# Altium project QUTMS-PDM-V00.PrjPcb (part 1 of 2)
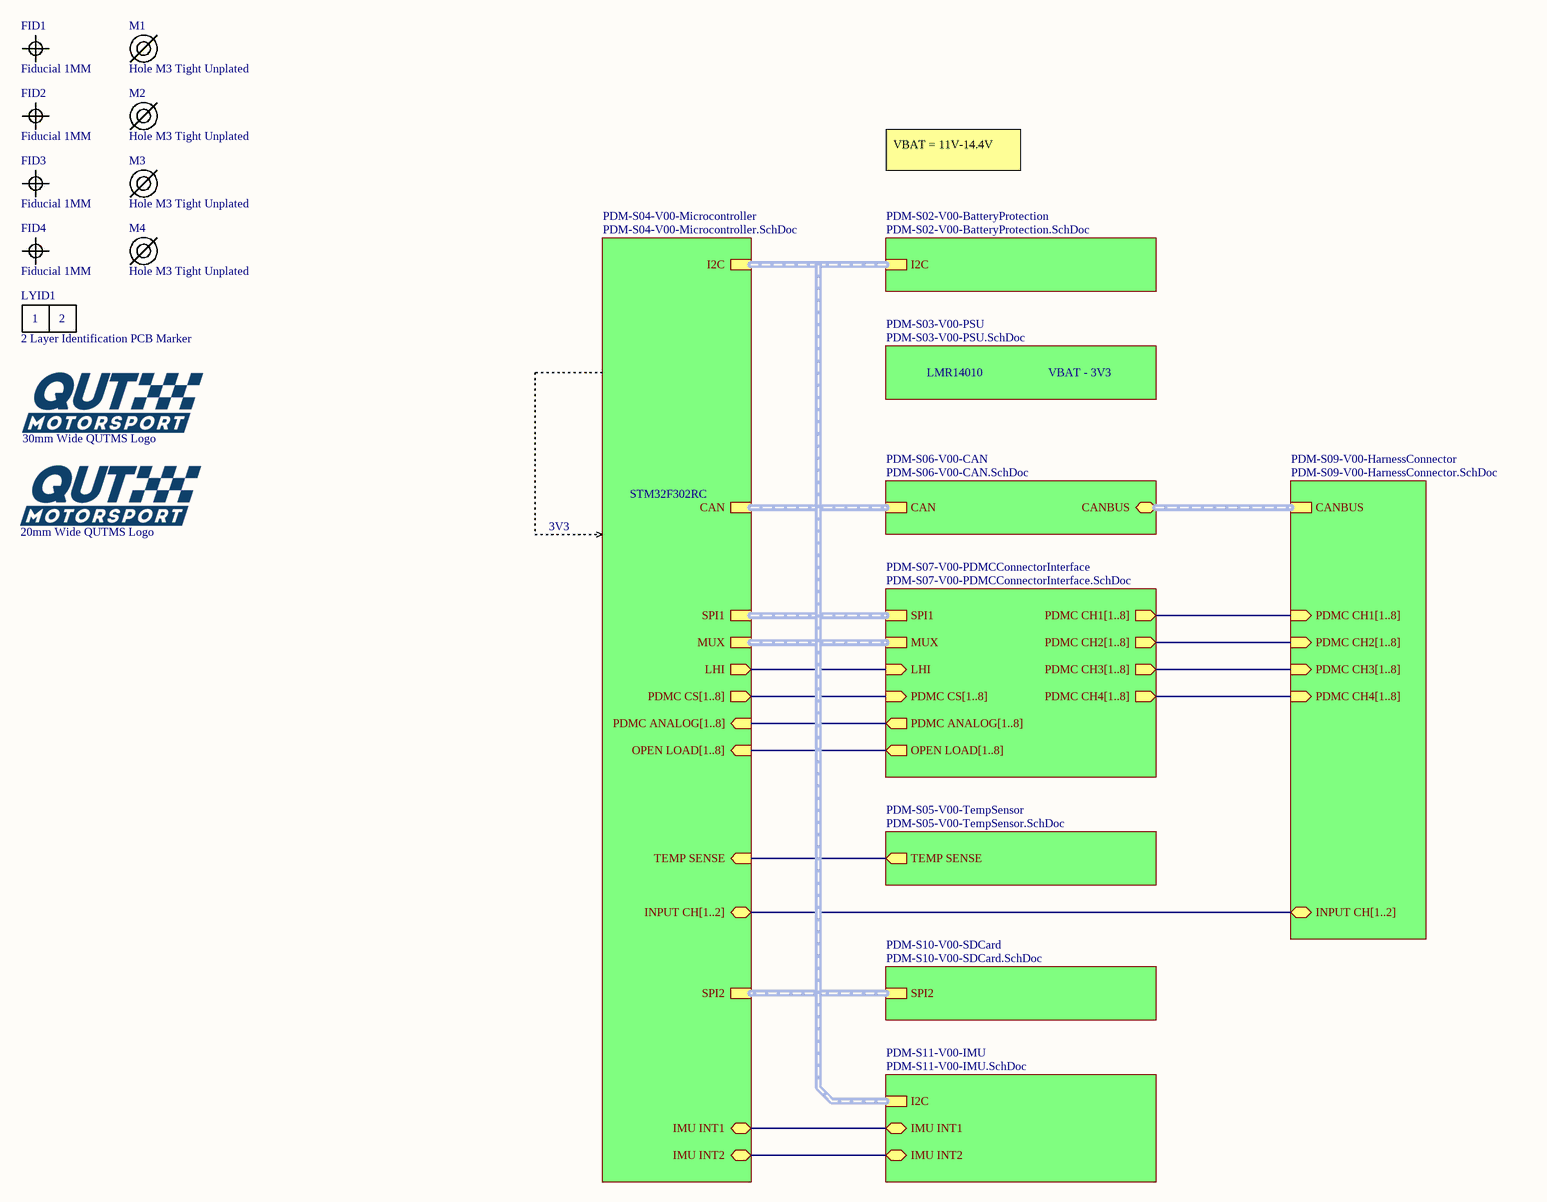
[diagram p0: PDM-S01-V00-PowerDistributionModule.SchDoc]
12 sheets, 95 parts. Net scope: hierarchical (ports join the sheet entries above them; power ports are global).
Board file: PDM-P00-V00.PcbDoc
Sheets:
  PDM-S01-V00-PowerDistributionModule.SchDoc
    PDM-S04-V00-Microcontroller = PDM-S04-V00-Microcontroller.SchDoc
    PDM-S06-V00-CAN = PDM-S06-V00-CAN.SchDoc
    PDM-S09-V00-HarnessConnector = PDM-S09-V00-HarnessConnector.SchDoc
    PDM-S03-V00-PSU = PDM-S03-V00-PSU.SchDoc
    PDM-S02-V00-BatteryProtection = PDM-S02-V00-BatteryProtection.SchDoc
    PDM-S07-V00-PDMCConnectorInterface = PDM-S07-V00-PDMCConnectorInterface.SchDoc
      PDM-S08-V00-PDMCConnector1 = PDM-S08-V00-PDMCConnector.SchDoc
      PDM-S08-V00-PDMCConnector2 = PDM-S08-V00-PDMCConnector.SchDoc
      PDM-S08-V00-PDMCConnector3 = PDM-S08-V00-PDMCConnector.SchDoc
      PDM-S08-V00-PDMCConnector4 = PDM-S08-V00-PDMCConnector.SchDoc
      PDM-S08-V00-PDMCConnector5 = PDM-S08-V00-PDMCConnector.SchDoc
      PDM-S08-V00-PDMCConnector6 = PDM-S08-V00-PDMCConnector.SchDoc
      PDM-S08-V00-PDMCConnector7 = PDM-S08-V00-PDMCConnector.SchDoc
      PDM-S08-V00-PDMCConnector8 = PDM-S08-V00-PDMCConnector.SchDoc
    PDM-S05-V00-TempSensor = PDM-S05-V00-TempSensor.SchDoc
    PDM-S10-V00-SDCard = PDM-S10-V00-SDCard.SchDoc
    PDM-S11-V00-IMU = PDM-S11-V00-IMU.SchDoc
  PDM-S12-V00-InputProtection.SchDoc

## Sheet PDM-S01-V00-PowerDistributionModule.SchDoc: PDM Master
size A3; DrawnBy: Zoe Goodward; Organization: QUT Motorsport; Address1: O-120, Gardens Point; Address2: 2 George Street; Address3: Brisbane, QLD 4000; Address4: Australia; DocumentNumber: 1; Revision: 01; SheetNumber: 1; SheetTotal: 9; Version: 01; Project: Power Distribution Module; PageSetup: Record=PageOptions|CenterHorizontal=True|CenterVertical=True|PrintScale=0.97|XCorrection=1.00|YCorrection=1.00|PrintKind=0|BorderSize=5000000|LeftOffset=0|BottomOffset=0|Orientation=2|PaperLength=1000|PaperWidth=1000|Scale=100|PaperSource=7|PrintQuality=-4|MediaType=1|DitherType=10|PaperKind=A4|PrintScaleMode=1

### Parts
FID1  Fiducial 1MM  [FIDUCIAL 1MM]
FID2  Fiducial 1MM  [FIDUCIAL 1MM]
FID3  Fiducial 1MM  [FIDUCIAL 1MM]
FID4  Fiducial 1MM  [FIDUCIAL 1MM]
LOGO1  30mm Wide QUTMS Logo  [QUTMS LOGO 30MM]
LOGO2  20mm Wide QUTMS Logo  [QUTMS LOGO 20MM]
LYID1  2 Layer Identification PCB Marker  [LAYER IDENT 2]
M1  Hole M3 Tight Unplated  [M3.2 UNPLATED]
M2  Hole M3 Tight Unplated  [M3.2 UNPLATED]
M3  Hole M3 Tight Unplated  [M3.2 UNPLATED]
M4  Hole M3 Tight Unplated  [M3.2 UNPLATED]

### Sub-sheets
PDM-S02-V00-BatteryProtection = PDM-S02-V00-BatteryProtection.SchDoc: I2C (harness I2C)
PDM-S03-V00-PSU = PDM-S03-V00-PSU.SchDoc: no entries
PDM-S04-V00-Microcontroller = PDM-S04-V00-Microcontroller.SchDoc: CAN (harness CAN), LHI (out), MUX (harness MUX), PDMC CS[1..8] (out), PDMC ANALOG[1..8] (in), TEMP SENSE (in), INPUT CH[1..2] (bidir), SPI2 (harness SPI2), I2C (harness I2C), OPEN LOAD[1..8] (in), SPI1 (harness SPI1), IMU INT1 (bidir), IMU INT2 (bidir)
PDM-S05-V00-TempSensor = PDM-S05-V00-TempSensor.SchDoc: TEMP SENSE (out)
PDM-S06-V00-CAN = PDM-S06-V00-CAN.SchDoc: CANBUS (bidir, harness CANBUS), CAN (harness CAN)
PDM-S07-V00-PDMCConnectorInterface = PDM-S07-V00-PDMCConnectorInterface.SchDoc: SPI1 (harness SPI1), PDMC CS[1..8] (in), MUX (harness MUX), PDMC CH4[1..8] (out), PDMC CH2[1..8] (out), LHI (in), PDMC CH1[1..8] (out), PDMC ANALOG[1..8] (out), PDMC CH3[1..8] (out), OPEN LOAD[1..8] (out)
PDM-S09-V00-HarnessConnector = PDM-S09-V00-HarnessConnector.SchDoc: CANBUS (harness CANBUS), PDMC CH1[1..8] (in), PDMC CH2[1..8] (in), PDMC CH3[1..8] (in), PDMC CH4[1..8] (in), INPUT CH[1..2] (bidir)
PDM-S10-V00-SDCard = PDM-S10-V00-SDCard.SchDoc: SPI2 (harness SPI2)
PDM-S11-V00-IMU = PDM-S11-V00-IMU.SchDoc: IMU INT1 (bidir), I2C (harness I2C), IMU INT2 (bidir)

### Nets
IMU INT1: sheet PDM-S04-V00-Microcontroller/IMU INT1, sheet PDM-S11-V00-IMU/IMU INT1
IMU INT2: sheet PDM-S04-V00-Microcontroller/IMU INT2, sheet PDM-S11-V00-IMU/IMU INT2
LHI: sheet PDM-S04-V00-Microcontroller/LHI, sheet PDM-S07-V00-PDMCConnectorInterface/LHI
TEMP SENSE: sheet PDM-S04-V00-Microcontroller/TEMP SENSE, sheet PDM-S05-V00-TempSensor/TEMP SENSE

### Buses and harness runs
bus sheet PDM-S04-V00-Microcontroller/INPUT CH[1..2] = sheet PDM-S09-V00-HarnessConnector/INPUT CH[1..2]
bus sheet PDM-S04-V00-Microcontroller/OPEN LOAD[1..8] = sheet PDM-S07-V00-PDMCConnectorInterface/OPEN LOAD[1..8]
bus sheet PDM-S04-V00-Microcontroller/PDMC ANALOG[1..8] = sheet PDM-S07-V00-PDMCConnectorInterface/PDMC ANALOG[1..8]
bus sheet PDM-S04-V00-Microcontroller/PDMC CS[1..8] = sheet PDM-S07-V00-PDMCConnectorInterface/PDMC CS[1..8]
bus sheet PDM-S07-V00-PDMCConnectorInterface/PDMC CH1[1..8] = sheet PDM-S09-V00-HarnessConnector/PDMC CH1[1..8]
bus sheet PDM-S07-V00-PDMCConnectorInterface/PDMC CH2[1..8] = sheet PDM-S09-V00-HarnessConnector/PDMC CH2[1..8]
bus sheet PDM-S07-V00-PDMCConnectorInterface/PDMC CH3[1..8] = sheet PDM-S09-V00-HarnessConnector/PDMC CH3[1..8]
bus sheet PDM-S07-V00-PDMCConnectorInterface/PDMC CH4[1..8] = sheet PDM-S09-V00-HarnessConnector/PDMC CH4[1..8]
harness sheet PDM-S02-V00-BatteryProtection/I2C = sheet PDM-S04-V00-Microcontroller/I2C = sheet PDM-S11-V00-IMU/I2C
harness sheet PDM-S04-V00-Microcontroller/CAN = sheet PDM-S06-V00-CAN/CAN
harness sheet PDM-S04-V00-Microcontroller/MUX = sheet PDM-S07-V00-PDMCConnectorInterface/MUX
harness sheet PDM-S04-V00-Microcontroller/SPI1 = sheet PDM-S07-V00-PDMCConnectorInterface/SPI1
harness sheet PDM-S04-V00-Microcontroller/SPI2 = sheet PDM-S10-V00-SDCard/SPI2
harness sheet PDM-S06-V00-CAN/CANBUS = sheet PDM-S09-V00-HarnessConnector/CANBUS

### Notes on the sheet
- VBAT = 11V-14.4V
- LMR14010
- VBAT - 3V3
- 3V3
- STM32F302RC
- Revision History:
- Sheet Title:
- Rev
- Date
- Description
- Project:
- Size:
- Drawn By:
- A3
- Number:
- Revision:
- Sheet
- Version:
- of
- QUT Motorsport
- O-120, Gardens Point
- 2 George Street
- Brisbane, QLD 4000
- Australia
- Print Date:
- Print Time:
- File Name:
- (in symbol Layer Identification 2) 1; 2

### Library data of the parts
LOGO1 = QUTMS Logo 30mm
LOGO2 = QUTMS Logo 20mm
LYID1 = Layer Identification 2
M1-M4 = Hole M3 Tight Unplated: M3.2 Hole, No Plating

## Sheet PDM-S04-V00-Microcontroller.SchDoc: Microcontroller
size A3; DrawnBy: Zoe Goodward; Organization: QUT Motorsport; Address1: O-120, Gardens Point; Address2: 2 George Street; Address3: Brisbane, QLD 4000; Address4: Australia; DocumentNumber: 4; Revision: 00; SheetNumber: 4; SheetTotal: 9; Version: 00; Project: Power Distribution Module; PageSetup: Record=PageOptions|CenterHorizontal=True|CenterVertical=True|PrintScale=0.97|XCorrection=1.00|YCorrection=1.00|PrintKind=0|BorderSize=5000000|LeftOffset=0|BottomOffset=0|Orientation=2|PaperLength=1000|PaperWidth=1000|Scale=100|PaperSource=7|PrintQuality=-4|MediaType=1|DitherType=10|PaperKind=A4|PrintScaleMode=1
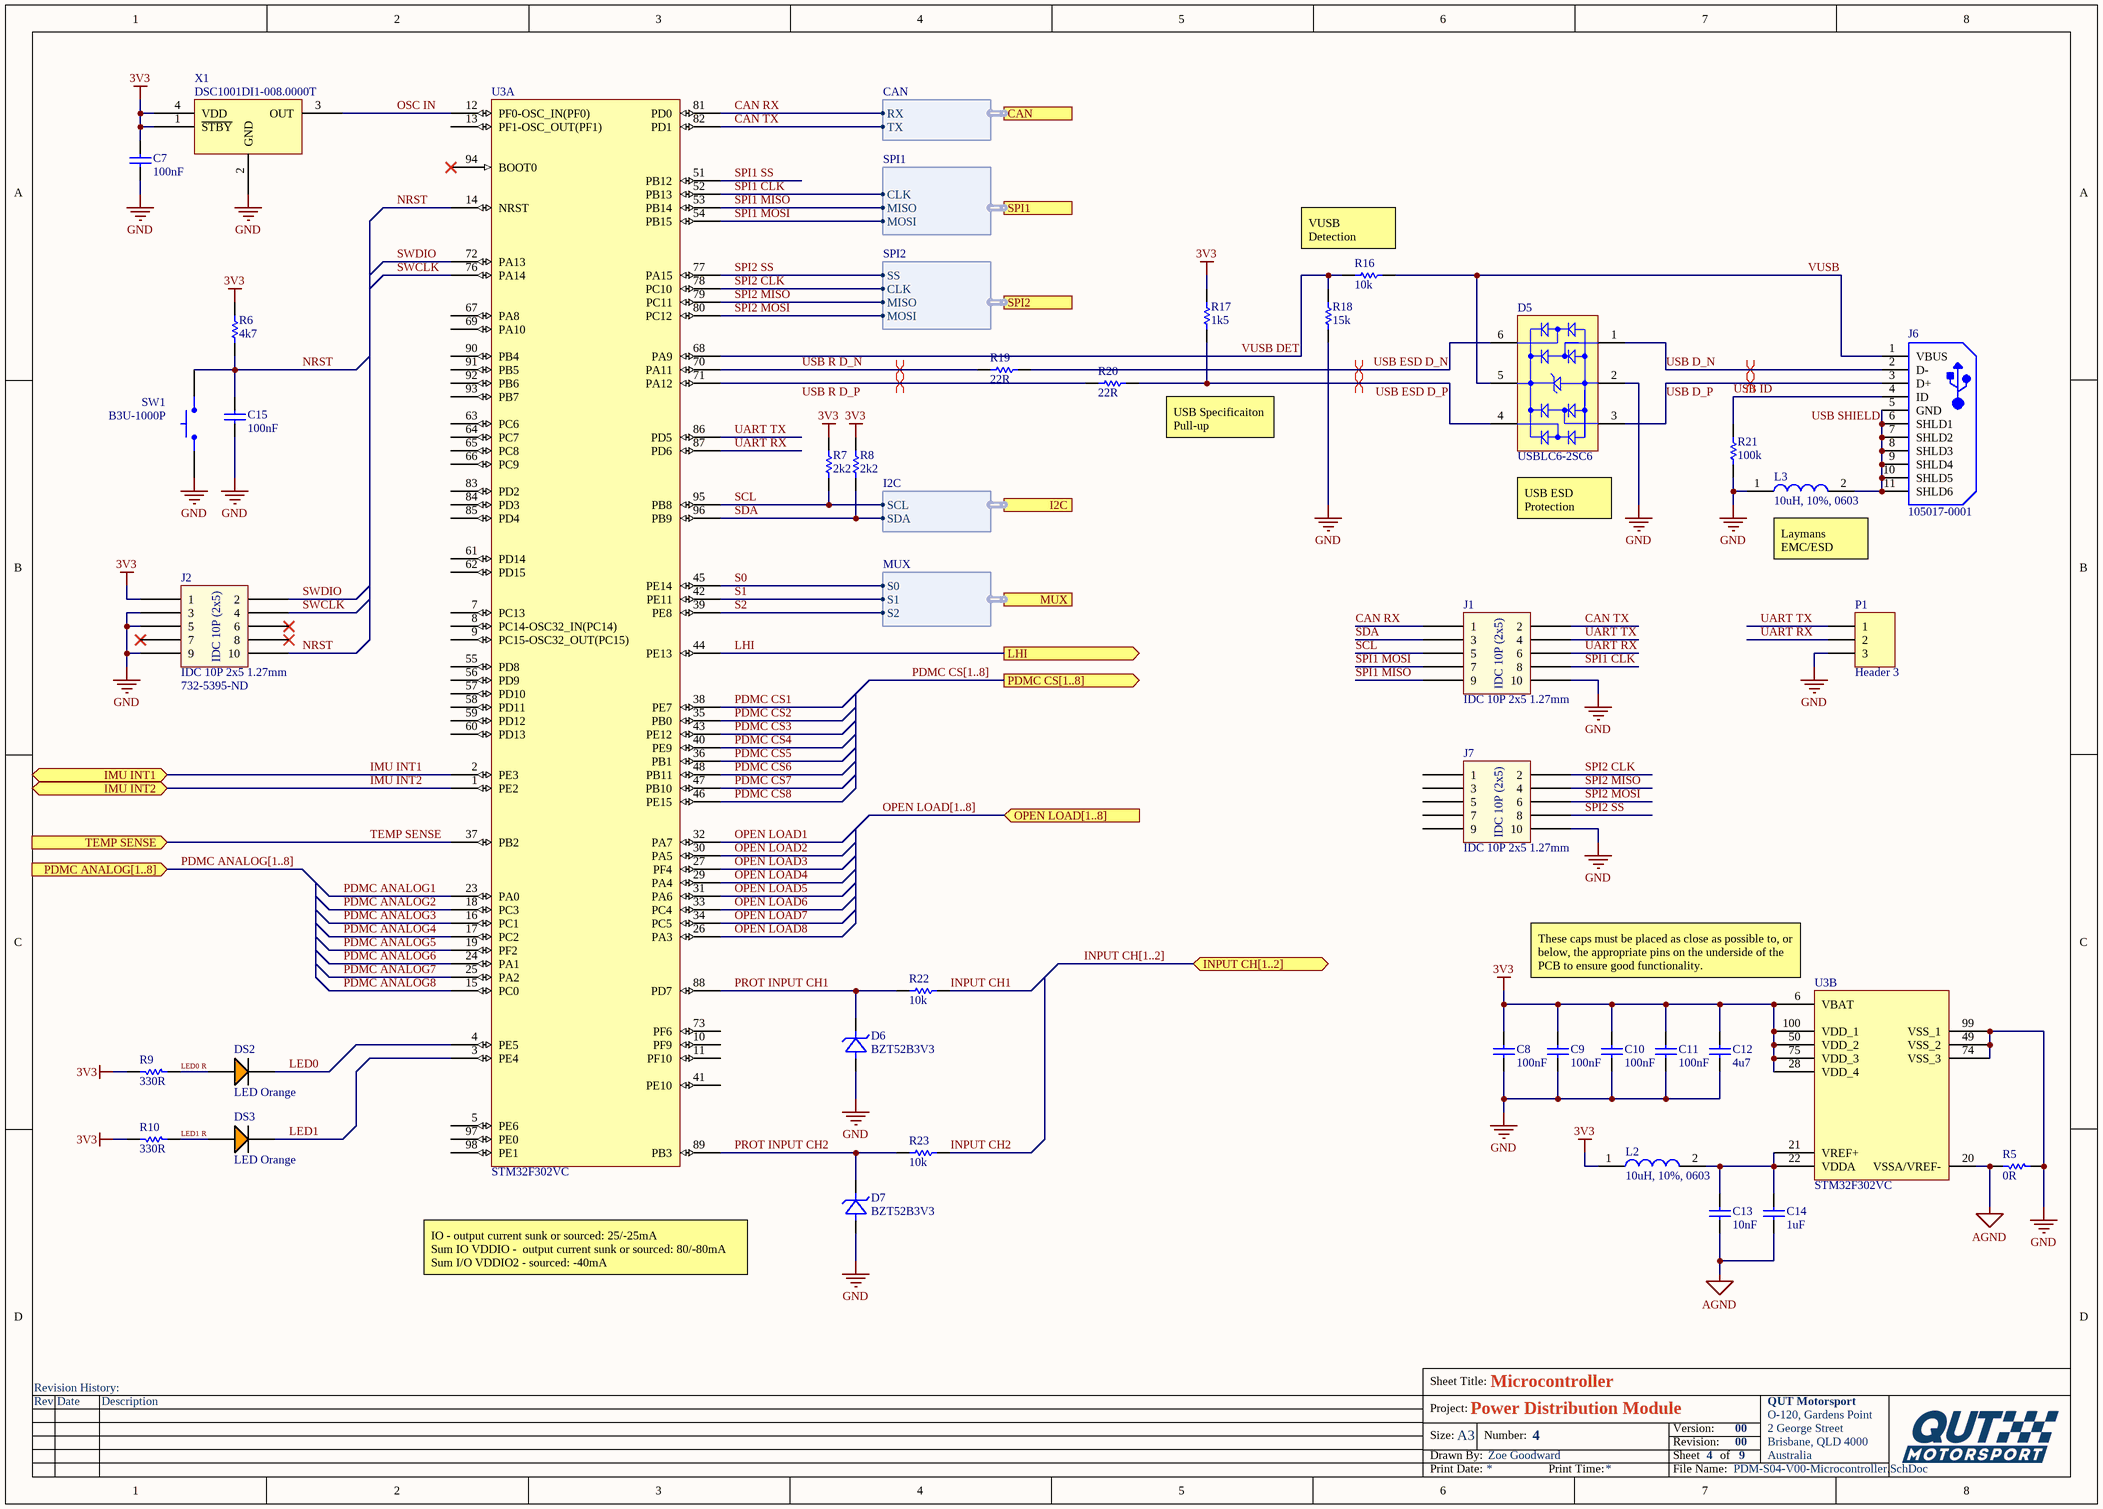
[diagram p1: PDM-S04-V00-Microcontroller.SchDoc]

### Parts
C7  100nF  [Cap_Ceramic_0603]
C8  100nF  [Cap_Ceramic_0603]
C9  100nF  [Cap_Ceramic_0603]
C10  100nF  [Cap_Ceramic_0603]
C11  100nF  [Cap_Ceramic_0603]
C12  4u7  [Cap_Ceramic_0603]
C13  10nF  [Cap_Ceramic_0603]
C14  1uF  [Cap_Ceramic_0603]
C15  100nF  [Cap_Ceramic_0603]
D5  USBLC6-2SC6  [STM-SOT23-6L_V]
D6  BZT52B3V3  [SOD123]
D7  BZT52B3V3  [SOD123]
DS2  LED Orange  [LED ORANGE 0603]
DS3  LED Orange  [LED ORANGE 0603]
J1  IDC 10P 2x5 1.27mm  [IDC 1.27MM 10P]
J2  IDC 10P 2x5 1.27mm  [IDC 1.27MM 10P]
J6  105017-0001  [USB-MICRO-B_V]
J7  IDC 10P 2x5 1.27mm  [IDC 1.27MM 10P]
L2  10uH, 10%, 0603  [Inductor_0603]
L3  10uH, 10%, 0603  [Inductor_0603]
P1  Header 3  [HDR1X3]
R5  0R  [Res_ThinFilm_0603]
R6  4k7  [Res_ThinFilm_0603]
R7  2k2  [Res_ThinFilm_0603]
R8  2k2  [Res_ThinFilm_0603]
R9  330R  [Res_ThinFilm_0603]
R10  330R  [Res_ThinFilm_0603]
R16  10k  [Res_ThinFilm_0603]
R17  1k5  [Res_ThinFilm_0603]
R18  15k  [Res_ThinFilm_0603]
R19  22R  [Res_ThinFilm_0603]
R20  22R  [Res_ThinFilm_0603]
R21  100k  [Res_ThinFilm_0603]
R22  10k  [Res_ThinFilm_0603]
R23  10k  [Res_ThinFilm_0603]
SW1  B3U-1000P  [BTN B3U-1000P]
U3  STM32F302VC  [STM-LQFP100]  (parts A,B of 2)
X1  DSC1001DI1-008.0000T  [DSC1001DI1-008.0000TCT-ND]

### Ports
CAN (harness CAN), I2C (harness I2C), IMU INT1 (bidir), IMU INT2 (bidir), INPUT CH[1..2] (bidir), LHI (out), MUX (harness MUX), OPEN LOAD[1..8] (in), PDMC ANALOG[1..8] (in), PDMC CS[1..8] (out), SPI1 (harness SPI1), SPI2 (harness SPI2), TEMP SENSE (in)

### Harnesses
CAN: RX, TX
SPI1: CLK, MISO, MOSI
MUX: S0, S1, S2
I2C: SDA, SCL
SPI2: CLK, MISO, MOSI, SS

### Nets
3V3: C7.2 C8.2 C9.2 C10.2 C11.2 C12.2 J2.1 L2.1 R6.2 R7.2 R8.2 R9.2 R10.2 R17.2 U3.6(VBAT) U3.28(VDD_4) U3.50(VDD_2) U3.75(VDD_3) U3.100(VDD_1) X1.1(~{STBY}) X1.4(VDD)
AGND: C13.1 C14.1 R5.2 U3.20(VSSA/VREF-)
GND: C7.1 C8.1 C9.1 C10.1 C11.1 C12.1 C15.1 D5.2(GND) D6.A(Anode) D7.A(Anode) J1.10 J2.3 J2.5 J2.9 J7.10 L3.1 P1.3 R5.1 R18.1 R21.1 SW1.1 U3.49(VSS_2) U3.74(VSS_3) U3.99(VSS_1) X1.2(GND)
CAN RX: J1.1 U3.81(PD0) ; port CAN.RX
CAN TX: J1.2 U3.82(PD1) ; port CAN.TX
IMU INT1: U3.2(PE3) ; port IMU INT1
IMU INT2: U3.1(PE2) ; port IMU INT2
INPUT CH1: R22.2
INPUT CH2: R23.2
LED0: DS2.2(C) U3.4(PE5)
LED0 R: DS2.1(A) R9.1
LED1: DS3.2(C) U3.3(PE4)
LED1 R: DS3.1(A) R10.1
LHI: U3.44(PE13) ; port LHI
NRST: C15.2 J2.10 R6.1 SW1.2 U3.14(NRST)
OPEN LOAD1: U3.32(PA7)  [project net OPEN LOAD]
OPEN LOAD2: U3.30(PA5)  [project net OPEN LOAD]
OPEN LOAD3: U3.27(PF4)  [project net OPEN LOAD]
OPEN LOAD4: U3.29(PA4)  [project net OPEN LOAD]
OPEN LOAD5: U3.31(PA6)  [project net OPEN LOAD]
OPEN LOAD6: U3.33(PC4)  [project net OPEN LOAD]
OPEN LOAD7: U3.34(PC5)  [project net OPEN LOAD]
OPEN LOAD8: U3.26(PA3)  [project net OPEN LOAD]
OSC IN: U3.12(PF0-OSC_IN(PF0)) X1.3(OUT)
PDMC ANALOG1: U3.23(PA0)  [project net ANALOG OUT]
PDMC ANALOG2: U3.18(PC3)  [project net ANALOG OUT]
PDMC ANALOG3: U3.16(PC1)  [project net ANALOG OUT]
PDMC ANALOG4: U3.17(PC2)  [project net ANALOG OUT]
PDMC ANALOG5: U3.19(PF2)  [project net ANALOG OUT]
PDMC ANALOG6: U3.24(PA1)  [project net ANALOG OUT]
PDMC ANALOG7: U3.25(PA2)  [project net ANALOG OUT]
PDMC ANALOG8: U3.15(PC0)  [project net ANALOG OUT]
PDMC CS1: U3.38(PE7)  [project net CS]
PDMC CS2: U3.35(PB0)  [project net CS]
PDMC CS3: U3.43(PE12)  [project net CS]
PDMC CS4: U3.40(PE9)  [project net CS]
PDMC CS5: U3.36(PB1)  [project net CS]
PDMC CS6: U3.48(PB11)  [project net CS]
PDMC CS7: U3.47(PB10)  [project net CS]
PDMC CS8: U3.46(PE15)  [project net CS]
PROT INPUT CH1: D6.K(Cathode) R22.1 U3.88(PD7)
PROT INPUT CH2: D7.K(Cathode) R23.1 U3.89(PB3)
S0: U3.45(PE14) ; port MUX.S0
S1: U3.42(PE11) ; port MUX.S1
S2: U3.39(PE8) ; port MUX.S2
SCL: J1.5 R7.1 U3.95(PB8) ; port I2C.SCL
SDA: J1.3 R8.1 U3.96(PB9) ; port I2C.SDA
SPI1 CLK: J1.8 U3.52(PB13) ; port SPI1.CLK  [project net SCK]
SPI1 MISO: J1.9 U3.53(PB14) ; port SPI1.MISO  [project net MISO]
SPI1 MOSI: J1.7 U3.54(PB15) ; port SPI1.MOSI  [project net MOSI]
SPI1 SS: U3.51(PB12)
SPI2 CLK: J7.2 U3.78(PC10) ; port SPI2.CLK  [project net SCK]
SPI2 MISO: J7.4 U3.79(PC11) ; port SPI2.MISO  [project net MISO]
SPI2 MOSI: J7.6 U3.80(PC12) ; port SPI2.MOSI  [project net MOSI]
SPI2 SS: J7.8 U3.77(PA15) ; port SPI2.SS
SWCLK: J2.4 U3.76(PA14)
SWDIO: J2.2 U3.72(PA13)
TEMP SENSE: U3.37(PB2) ; port TEMP SENSE
UART RX: J1.6 P1.2 U3.87(PD6)
UART TX: J1.4 P1.1 U3.86(PD5)
USB D_N: D5.1(I/O_1) J6.2(D-)
USB D_P: D5.3(I/O_2) J6.3(D+)
USB ESD D_N: D5.6(I/O_4) R19.2
USB ESD D_P: D5.4(I/O_3) R17.1 R20.2
USB ID: J6.4(ID) R21.2
USB R D_N: R19.1 U3.70(PA11)
USB R D_P: R20.1 U3.71(PA12)
USB SHIELD: J6.5(GND) J6.6(SHLD1) J6.7(SHLD2) J6.8(SHLD3) J6.9(SHLD4) J6.10(SHLD5) J6.11(SHLD6) L3.2
VUSB: D5.5(VBUS) J6.1(VBUS) R16.2
VUSB DET: R16.1 R18.2 U3.68(PA9)
NetC13_2: C13.2 C14.2 L2.2 U3.21(VREF+) U3.22(VDDA)

Not connected (* = marked no-connect by the designer): J2 6* 7* 8*; J7 1 3 5 7 9; U3 5(PE6) 7(PC13) 8(PC14-OSC32_IN(PC14)) 9(PC15-OSC32_OUT(PC15)) 10(PF9) 11(PF10) 13(PF1-OSC_OUT(PF1)) 41(PE10) 55(PD8) 56(PD9) 57(PD10) 58(PD11) 59(PD12) 60(PD13) 61(PD14) 62(PD15) 63(PC6) 64(PC7) 65(PC8) 66(PC9) 67(PA8) 69(PA10) 73(PF6) 83(PD2) 84(PD3) 85(PD4) 90(PB4) 91(PB5) 92(PB6) 93(PB7) 94(BOOT0)* 97(PE0) 98(PE1)

### Buses and harness runs
bus INPUT CH[1..2] = port INPUT CH[1..2]
bus OPEN LOAD[1..8] = port OPEN LOAD[1..8]
bus PDMC ANALOG[1..8] = port PDMC ANALOG[1..8]
bus PDMC CS[1..8] = port PDMC CS[1..8]

### Layout directives
differential pair; USB D: true: USB D_N, USB D_P
differential pair: USB ESD D_N, USB ESD D_P, USB R D_N, USB R D_P

### Notes on the sheet
- (near R16) VUSB Detection
- USB Specificaiton Pull-up
- USB ESD Protection
- (near L3) Laymans EMC/ESD
- (near J2) 732-5395-ND
- (near U3) These caps must be placed as close as possible to, or below, the appropriate pins on the underside of the PCB to ensure good functionality.
- IO - output current sunk or sourced: 25/-25mA
  Sum IO VDDIO -  output current sunk or sourced: 80/-80mA
  Sum I/O VDDIO2 - sourced: -40mA
- Revision History:
- Sheet Title:
- Rev
- Date
- Description
- Project:
- Size:
- Drawn By:
- A3
- Number:
- Revision:
- Sheet
- Version:
- of
- QUT Motorsport
- O-120, Gardens Point
- 2 George Street
- Brisbane, QLD 4000
- Australia
- Print Date:
- Print Time:
- File Name:
- (in symbol IDC 10P 2x5 1.27mm) IDC 10P (2x5)

### Library data of the parts
C7-C11 C15 = 100nF 50V 5% X7R 0603: Capacitor, Ceramic, SMD, 100nF, 50V, 5%, X7R, 0603
C12 = 4u7 50V 5% X7R 0603: Capacitor, Ceramic, SMD, 4u7, 50V, 5%, X7R, 0603
C13 = 10nF 50V 5% X7R 0603: Capacitor, Ceramic, SMD, 10nF, 50V, 5%, X7R, 0603
C14 = 1uF 25V 5% X7R 0603: Capacitor, Ceramic, SMD, 1uF, 25V, 5%, X7R, 0603
D5 = CMP-2000-05378-1: Very low capacitance ESD protection, 3.5 pF, -40 to 125 degC, 6-Pin SOT23, RoHS, Tape and Reel; Manufacturer: STMicroelectronics; Polarity: Uni-Directional; Clamping Voltage: 17V; Rad Hardened: No; Product Height (mm): 1.3mm; Leakage Current (Max): 0.15uA; Product Length (mm): 3.05mm; Number of Elements: 1; Peak Pulse Current: 5A; Configuration: Dual; Reverse Breakdown Voltage: 6V; Working Voltage (Max): 5V; Capacitance Value: 3.5pF; Suppressor Type: DiodeArrays; Product Depth (mm): 1.75mm; Test Current (It): 1mA; Package / Case: SOT-23; Operating Temperature Max Deg. C: 125C; Package Description: 6-Pin Small Outline Transistor, Body 2.925 x 1.625 mm, Pitch 0.95 mm; Package Reference: SOT23-6L; Datasheet Version: Rev. 5, 10/2011; Operating Temperature Min Deg. C: -40C; Mounting Style: SurfaceMount; Direction Type: Uni-Directional; Mounting: SurfaceMount; Pin Count: 6; Leakage Current: 0.15uA; Packaging: TapeandReel; Operating Temperature Classification: Automotive; Clamping Voltage (Max): 17V; Manufacturer URL: http://www.st.com/; Reverse Stand-off Voltage: 5V; Datasheet URL: http://www.st.com/st-web-ui/static/active/en/resource/technical/document/datasheet/CD00050750.pdf; Working Voltage: 5V; Operating Temp Range: -40Cto125C
D6 D7 = BZT52B3V3: Diode, SMD, Zener, 3.3V, 2%, 410mW, SOD-123; ComponentLink1Description: Datasheet; ComponentLink1URL: https://www.vishay.com/docs/85760/bzt52.pdf; ComponentLink2Description: Digikey; ComponentLink2URL: https://www.digikey.com/product-detail/en/vishay-semiconductor-diodes-division/BZT52B3V3-E3-08/112-BZT52B3V3-E3-08CT-ND/8564806
DS2 DS3 = LED ORANGE 0603
J6 = CMP-2000-05827-1: Micro-USB B Receptacle, Right Angle, Bottom Mount, Surface Mount, with Solder Tabs, -30 to 85 degC, 5-Pin USB, RoHS, Tape and Reel; Manufacturer: Molex; Featured Product: Micro-USBConnectorsUSBConnectors; Other Names: WM1399DKR; Package Version: Rev. F, 12/2012; Number of Contacts: 5; Connector Type: USB-microB; Catalog Drawings: 1050170001; 3D Model: 105017-0001.stp; Mating Products: WM17145-ND-CABLEMICROUSBBTOSTDA1.0MWM17147-ND-CABLEMICROUSBBTOSTDA2.0MWM17146-ND-CABLEMICROUSBBTOSTDA1.5M; PCN Assembly/Origin: ResinSupplier21/Oct/2015; Voltage - Max: 30V; Online Catalog: Molex-MicroUSB; Manufacturer URL: http://www.molex.com/; Package Description: 5-Leads USB, Micro B, Body 7.5 x 5 mm, Pitch 0.65 mm; Datasheet URL: http://www.molex.com/elqNow/elqRedir.htm?ref=http://www.molex.com/webdocs/datasheets/pdf/en-us/1050170001_IO_CONNECTORS.pdf; Ingress Protection: -; Datasheet Version: 03/2016; Mounting Type: BoardCutout,SurfaceMount,RightAngle; Circuits: 5; Standard Package: 1; Package Reference: MICRO-B; Package URL: http://www.molex.com/pdm_docs/sd/1050170001_sd.pdf; Category: Connectors,Interconnects; Series: -; RoHS Information: 1050170001CertofCompliance; Features: Shielded,SolderRetention; Family: USB,DVI,HDMIConnectors; Specifications: -; Gender: Receptacle; Packaging: Digi-Reel®; Mounting Technology: SurfaceMount
P1 = Header 3: Header, 3-Pin; LatestRevisionDate: 17-Jul-2002; LatestRevisionNote: Re-released for DXP Platform.; Publisher: Altium Limited
R5 = 0R 5% 0603: Resistor, SMD, 0R, 0.1W, 5%, 0603
R6 = 4k7 5% 0603: Resistor, SMD, 4k7, 0.1W, 5%, 0603
R7 R8 = 2k2 5% 0603: Resistor, SMD, 2k2, 0.1W, 5%, 0603
R9 R10 = 330R 5% 0603: Resistor, SMD, 330R, 0.1W, 5%, 0603
R16 = 10k 1% 0603: Resistor, SMD, 10k, 0.1W, 1%, 0603
R17 = 1k5 5% 0603: Resistor, SMD, 1k5, 0.1W, 5%, 0603
R18 = 15k 5% 0603: Resistor, SMD, 15k, 0.1W, 5%, 0603
R19 R20 = 22R 5% 0603: Resistor, SMD, 22R, 0.1W, 5%, 0603
R21 = 100k 5%, 0603: Resistor, SMD, 100k, 0.1W, 5%, 0603
R22 R23 = 10k 5% 0603: Resistor, SMD, 10k, 0.1W, 5%, 0603
SW1 = BTN B3U-1000P: Omron B3U-1000P Ultra Miniture Switch; ComponentLink1Description: LCSC; ComponentLink1URL: https://lcsc.com/product-detail/Tactile-Switches_BRIGHT-TSA063G50-250_C294565.html
U3 = STM32F302VC: ARM Cortex-M4 32-bit MCU, 256 KB Flash, 32 KB Internal RAM, 87 I/Os, 100-pin LQFP, -40 to 85 degC; PartNumber: STM32F302VCT6; FLASH Size (Prog) (kB): 256; Supply Voltage(Vcc) min (V): 2; Internal RAM Size (kB): 32; I/Os (High Current): 87; D/A Converter: 1x12-bit (1 Channel); Packing: Tray; Operating Frequency(F) (Processor speed) (MHz): 72; ComponentLink1URL: http://www.st.com/web/en/home.html; PackageDescription: 100-Pin Low Profile Quad Flat Package, 14 x 14 mm Body, 0.5 mm Pitch; ComponentLink1Description: Manufacturer URL; ComponentLink2URL: http://www.st.com/st-web-ui/static/active/en/resource/technical/document/datasheet/DM00058181.pdf; Mounting Technology: Surface Mount; Core: ARM Cortex-M4; ComponentLink2Description: Datasheet; ComponentLink3Description: Package Specification; PackageVersion: Rev. 1, 06/2013; ComponentLink3URL: http://www.st.com/st-web-ui/static/active/en/resource/technical/document/data_brief/DM00071938.pdf; PackageReference: LQFP100; DatasheetVersion: Rev. 6
X1 = DSC1001DI1-008.0000T: 8MHz XO (Standard) CMOS Oscillator 1.8 ~ 3.3V Standby (Power Down) 4-SMD, No Lead
L2 L3 = 10uH, 10%, 0603: ComponentLink1Description: Digikey; ComponentLink1URL: https://www.digikey.com.au/product-detail/en/w%C3%BCrth-elektronik/74404064221/732-7261-1-ND/5353241; ComponentLink2Description: LCSC A; ComponentLink2URL: https://lcsc.com/product-detail/Power-Inductors_Sunlord-SWPA6045S221MT_C91047.html; ComponentLink3Description: LCSC B; ComponentLink3URL: https://lcsc.com/product-detail/Power-Inductors_SXN-Shun-Xiang-Nuo-Elec-SMNR6045-221MT_C467145.html

## Sheet PDM-S06-V00-CAN.SchDoc: CAN Bus
size A3; DrawnBy: Jonn Dillon; Organization: QUT Motorsport; Address1: O-120, Gardens Point; Address2: 2 George Street; Address3: Brisbane, QLD 4000; Address4: Australia; DocumentNumber: 6; Revision: 01; SheetNumber: 6; SheetTotal: 9; Version: 01; Project: Power Distribution Module; PageSetup: Record=PageOptions|CenterHorizontal=True|CenterVertical=True|PrintScale=0.97|XCorrection=1.00|YCorrection=1.00|PrintKind=0|BorderSize=5000000|LeftOffset=0|BottomOffset=0|Orientation=2|PaperLength=1000|PaperWidth=1000|Scale=100|PaperSource=7|PrintQuality=-4|MediaType=1|DitherType=10|PaperKind=A4|PrintScaleMode=1
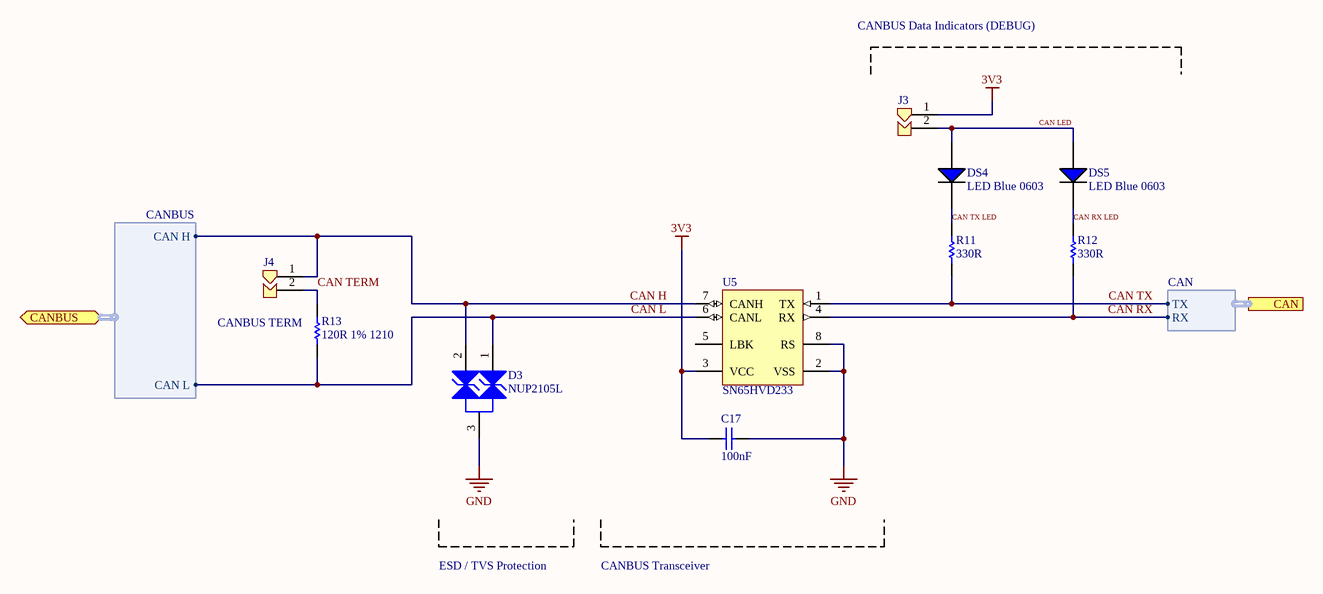
[diagram p2: PDM-S06-V00-CAN.SchDoc]

### Parts
C17  100nF  [Cap_Ceramic_0603]
D3  NUP2105L  [NUP2105L]
DS4  LED Blue 0603  [LED BLUE 0603]
DS5  LED Blue 0603  [LED BLUE 0603]
J3  Jumper 2Way Solderable  [Jumper_2Way_Solderable]  (value not drawn)
J4  Jumper 2Way Solderable  [Jumper_2Way_Solderable]  (value not drawn)
R11  330R  [Res_ThinFilm_0603]
R12  330R  [Res_ThinFilm_0603]
R13  120R 1% 1210  [Res_ThinFilm_1210]
U5  SN65HVD233  [SN65HVD233DR]

### Ports
CAN (harness CAN), CANBUS (bidir, harness CANBUS)

### Harnesses
CANBUS: CAN H, CAN L
CAN: RX, TX

### Nets
3V3: C17.2 J3.1 U5.3(VCC)
GND: C17.1 D3.3 U5.2(VSS) U5.8(RS)
CAN H: D3.2 J4.1 U5.7(CANH) ; port CANBUS.CAN H
CAN L: D3.1 R13.1 U5.6(CANL) ; port CANBUS.CAN L
CAN LED: DS4.1(A) DS5.1(A) J3.2
CAN RX: R12.1 U5.4(RX) ; port CAN.RX
CAN RX LED: DS5.2(C) R12.2
CAN TERM: J4.2 R13.2
CAN TX: R11.1 U5.1(TX) ; port CAN.TX
CAN TX LED: DS4.2(C) R11.2

Not connected (* = marked no-connect by the designer): U5 5(LBK)

### Notes on the sheet
- CANBUS Data Indicators (DEBUG)
- (near R13) CANBUS TERM
- ESD / TVS Protection
- CANBUS Transceiver
- Revision History:
- Sheet Title:
- Rev
- Date
- Description
- Project:
- Size:
- Drawn By:
- A3
- Number:
- Revision:
- Sheet
- Version:
- of
- QUT Motorsport
- O-120, Gardens Point
- 2 George Street
- Brisbane, QLD 4000
- Australia
- Print Date:
- Print Time:
- File Name:

### Library data of the parts
C17 = 100nF 50V 5% X7R 0603: as C7 on sheet PDM-S04-V00-Microcontroller
J3 J4 = Jumper 2Way Side Solderable
R11 R12 = 330R 5% 0603: Resistor, SMD, 330R, 0.1W, 5%, 0603
R13 = 120R 1% 1210: Resistor, SMD, 120R, 0.25W, 1%, 1210
D3 = NUP2105L: ComponentLink1Description: Datasheet; ComponentLink1URL: https://www.onsemi.cn/PowerSolutions/document/NUP2105L-D.PDF; Parameter 1: *; ComponentLink2Description: LCSC; ComponentLink2URL: https://lcsc.com/product-detail/TVS_ON-Semiconductor-NUP2105LT1G_C14486.html; ComponentLink3Description: Digikey; ComponentLink3URL: https://www.digikey.com.au/product-detail/en/on-semiconductor/SZNUP2105LT1G/SZNUP2105LT1GOSCT-ND/3487669
U5 = SN65HVD233: ComponentLink1Description: LCSC; ComponentLink1URL: https://lcsc.com/product-detail/CAN-ICs_Texas-Instruments_SN65HVD233DRG4_Texas-Instruments-Texas-Instruments-SN65HVD233DRG4_C61643.html; ComponentLink2Description: Digikey; ComponentLink2URL: https://www.digikey.com.au/product-detail/en/texas-instruments/SN65HVD233DR/296-35967-1-ND/4134960; ComponentLink3Description: Datasheet; ComponentLink3URL: https://www.ti.com/lit/ds/symlink/sn65hvd233.pdf?ts=1588560888178; ComponentLink4Description: Ti Product Page; ComponentLink4URL: https://www.ti.com/product/SN65HVD233

## Sheet PDM-S09-V00-HarnessConnector.SchDoc: Harness Connectors
size A3; DrawnBy: Zoe Goodward; Organization: QUT Motorsport; Address1: O-120, Gardens Point; Address2: 2 George Street; Address3: Brisbane, QLD 4000; Address4: Australia; DocumentNumber: 9; Revision: 01; SheetNumber: 9; SheetTotal: 9; Version: 01; Project: Power Distribution Module; PageSetup: Record=PageOptions|CenterHorizontal=True|CenterVertical=True|PrintScale=0.97|XCorrection=1.00|YCorrection=1.00|PrintKind=0|BorderSize=5000000|LeftOffset=0|BottomOffset=0|Orientation=2|PaperLength=1000|PaperWidth=1000|Scale=100|PaperSource=7|PrintQuality=-4|MediaType=1|DitherType=10|PaperKind=A4|PrintScaleMode=1
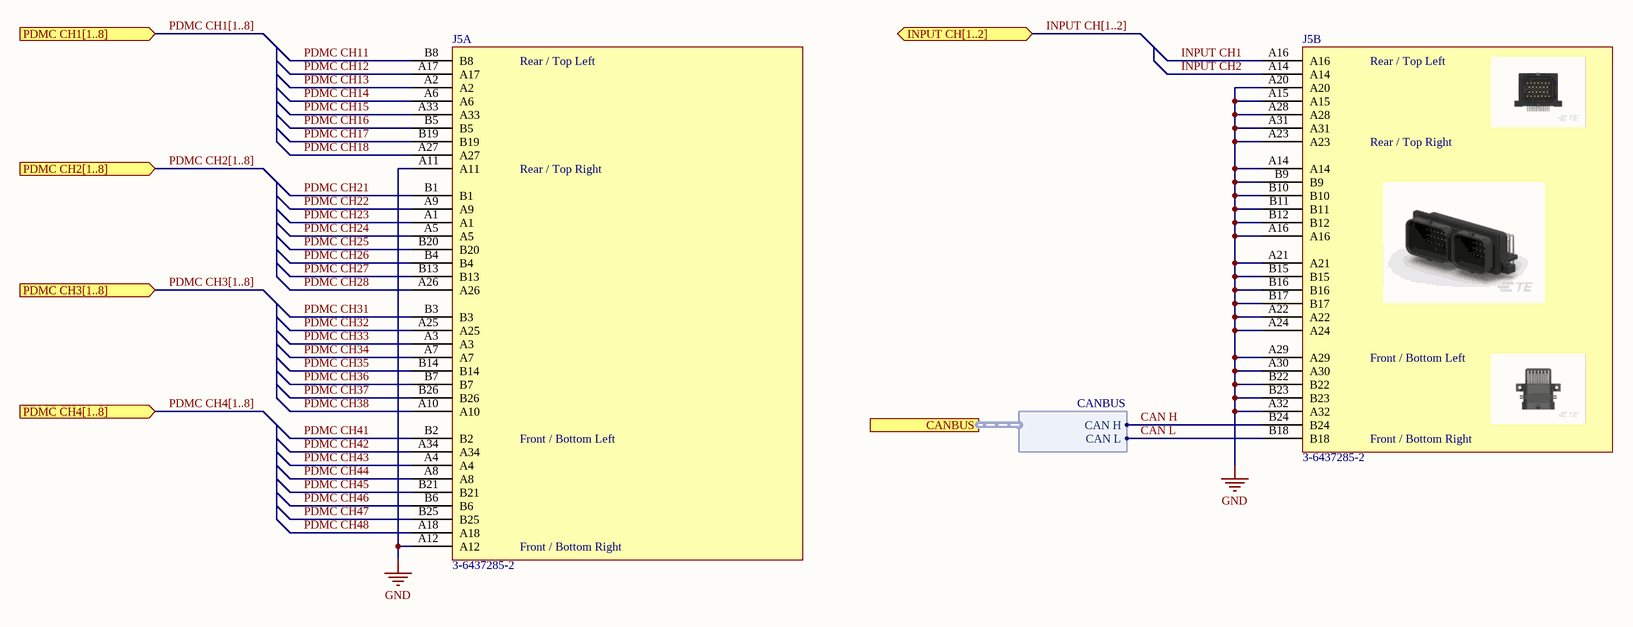
[diagram p3: PDM-S09-V00-HarnessConnector.SchDoc]

### Parts
J5  3-6437285-2  [SUPER SEAL RIGHT 60POS]  (parts A,B of 2)

### Ports
CANBUS (harness CANBUS), INPUT CH[1..2] (bidir), PDMC CH1[1..8] (in), PDMC CH2[1..8] (in), PDMC CH3[1..8] (in), PDMC CH4[1..8] (in)

### Harnesses
CANBUS: CAN H, CAN L

### Nets
GND: J5.A11 J5.A12 J5.A14 J5.A15 J5.A16 J5.A20 J5.A21 J5.A22 J5.A23 J5.A24 J5.A28 J5.A29 J5.A30 J5.A31 J5.A32 J5.B9 J5.B10 J5.B11 J5.B12 J5.B15 J5.B16 J5.B17 J5.B22 J5.B23
CAN H: J5.B24 ; port CANBUS.CAN H
CAN L: J5.B18 ; port CANBUS.CAN L
INPUT CH1: J5.A16
INPUT CH2: J5.A14
PDMC CH11: J5.B8  [project net PDMC CH1]
PDMC CH12: J5.A17  [project net PDMC CH1]
PDMC CH13: J5.A2  [project net PDMC CH1]
PDMC CH14: J5.A6  [project net PDMC CH1]
PDMC CH15: J5.A33  [project net PDMC CH1]
PDMC CH16: J5.B5  [project net PDMC CH1]
PDMC CH17: J5.B19  [project net PDMC CH1]
PDMC CH18: J5.A27  [project net PDMC CH1]
PDMC CH21: J5.B1  [project net PDMC CH2]
PDMC CH22: J5.A9  [project net PDMC CH2]
PDMC CH23: J5.A1  [project net PDMC CH2]
PDMC CH24: J5.A5  [project net PDMC CH2]
PDMC CH25: J5.B20  [project net PDMC CH2]
PDMC CH26: J5.B4  [project net PDMC CH2]
PDMC CH27: J5.B13  [project net PDMC CH2]
PDMC CH28: J5.A26  [project net PDMC CH2]
PDMC CH31: J5.B3  [project net PDMC CH3]
PDMC CH32: J5.A25  [project net PDMC CH3]
PDMC CH33: J5.A3  [project net PDMC CH3]
PDMC CH34: J5.A7  [project net PDMC CH3]
PDMC CH35: J5.B14  [project net PDMC CH3]
PDMC CH36: J5.B7  [project net PDMC CH3]
PDMC CH37: J5.B26  [project net PDMC CH3]
PDMC CH38: J5.A10  [project net PDMC CH3]
PDMC CH41: J5.B2  [project net PDMC CH4]
PDMC CH42: J5.A34  [project net PDMC CH4]
PDMC CH43: J5.A4  [project net PDMC CH4]
PDMC CH44: J5.A8  [project net PDMC CH4]
PDMC CH45: J5.B21  [project net PDMC CH4]
PDMC CH46: J5.B6  [project net PDMC CH4]
PDMC CH47: J5.B25  [project net PDMC CH4]
PDMC CH48: J5.A18  [project net PDMC CH4]

### Buses and harness runs
bus INPUT CH[1..2] = port INPUT CH[1..2]
bus PDMC CH1[1..8] = port PDMC CH1[1..8]
bus PDMC CH2[1..8] = port PDMC CH2[1..8]
bus PDMC CH3[1..8] = port PDMC CH3[1..8]
bus PDMC CH4[1..8] = port PDMC CH4[1..8]

### Notes on the sheet
- Revision History:
- Sheet Title:
- Rev
- Date
- Description
- Project:
- Size:
- Drawn By:
- A3
- Number:
- Revision:
- Sheet
- Version:
- of
- QUT Motorsport
- O-120, Gardens Point
- 2 George Street
- Brisbane, QLD 4000
- Australia
- Print Date:
- Print Time:
- File Name:
- (in symbol 3-6437285-2, part A) Rear / Top Left; Rear / Top Right; Front / Bottom Left; Front / Bottom Right
- (in symbol 3-6437285-2, part B) Rear / Top Left; Rear / Top Right; Front / Bottom Left; Front / Bottom Right

### Library data of the parts
J5 = 3-6437285-2: Connector Header Through Hole, Right Angle 60 position 0.118" (3.00mm), 1.00mm contacts; ComponentLink1Description: Manufacturer; ComponentLink1URL: https://www.te.com/global-en/product-3-6437285-2.html

## Sheet PDM-S03-V00-PSU.SchDoc: Power Supply (V-V to 3V3 @ 0.?-0.?A)
size A3; DrawnBy: Jonn Dillon; Organization: QUT Motorsport; Address1: O-120, Gardens Point; Address2: 2 George Street; Address3: Brisbane, QLD 4000; Address4: Australia; DocumentNumber: 3; Revision: 01; SheetNumber: 3; SheetTotal: 9; Version: 01; Project: Power Distribution Module; PageSetup: Record=PageOptions|CenterHorizontal=True|CenterVertical=True|PrintScale=0.97|XCorrection=1.00|YCorrection=1.00|PrintKind=0|BorderSize=5000000|LeftOffset=0|BottomOffset=0|Orientation=2|PaperLength=1000|PaperWidth=1000|Scale=100|PaperSource=7|PrintQuality=-4|MediaType=1|DitherType=10|PaperKind=A4|PrintScaleMode=1
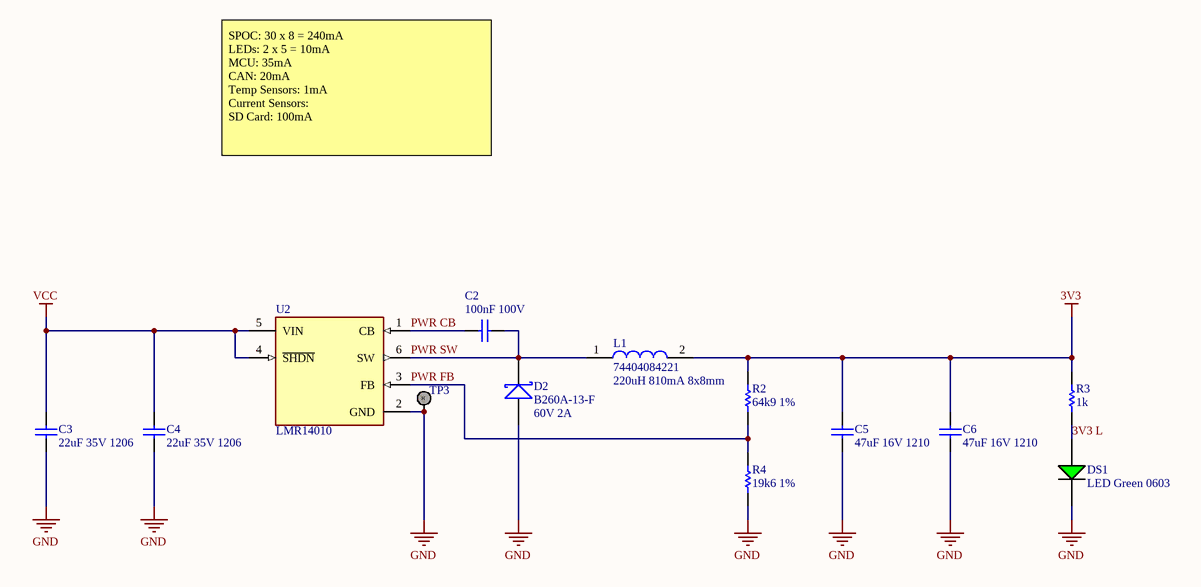
[diagram p4: PDM-S03-V00-PSU.SchDoc]

### Parts
C2  100nF 100V  [Cap_Ceramic_0603]
C3  22uF 35V 1206  [Cap_Ceramic_1206]
C4  22uF 35V 1206  [Cap_Ceramic_1206]
C5  47uF 16V 1210  [Cap_Ceramic_1210]
C6  47uF 16V 1210  [Cap_Ceramic_1210]
D2  B260A-13-F  [SMA]
DS1  LED Green 0603  [LED GREEN 0603]
L1  74404084221  [Inductor_8x8mm]
R2  64k9 1%  [Res_ThinFilm_0603]
R3  1k  [Res_ThinFilm_0603]
R4  19k6 1%  [Res_ThinFilm_0603]
TP3  TestPoint_Hoop_Black  [TestPointHoop_BLACK]  (value not drawn)
U2  LMR14010  [LMR14010]

### Nets
3V3: C5.2 C6.2 L1.2 R2.2 R3.2
GND: C3.1 C4.1 C5.1 C6.1 D2.A DS1.2(C) R4.1 TP3.1 U2.2(GND)
VCC: C3.2 C4.2 U2.4(~{SHDN}) U2.5(VIN)
3V3 L: DS1.1(A) R3.1
PWR CB: C2.1 U2.1(CB)
PWR FB: R2.1 R4.2 U2.3(FB)
PWR SW: C2.2 D2.K L1.1 U2.6(SW)

### Notes on the sheet
- SPOC: 30 x 8 = 240mA
  LEDs: 2 x 5 = 10mA
  MCU: 35mA
  CAN: 20mA
  Temp Sensors: 1mA
  Current Sensors:
  SD Card: 100mA
- (near L1) 220uH 810mA 8x8mm
- (near D2) 60V 2A
- Revision History:
- Sheet Title:
- Rev
- Date
- Description
- Project:
- Size:
- Drawn By:
- A3
- Number:
- Revision:
- Sheet
- Version:
- of
- QUT Motorsport
- O-120, Gardens Point
- 2 George Street
- Brisbane, QLD 4000
- Australia
- Print Date:
- Print Time:
- File Name:
- (in symbol TestPoint_Hoop_Black) H

### Library data of the parts
C2 = 100nF 100V 5% X7R 0603: Capacitor, Ceramic, SMD, 100nF, 100V, 5%, X7R, 0603
C3 C4 = 22uF 35V 10% X7R 1206: Capacitor, Ceramic, SMD, 22uF, 35V, 10%, X7R, 1206
C5 C6 = 47uF 16V 10% X7R 1210: Capacitor, Ceramic, SMD, 47uF, 16V, 5%, X7R, 1210
D2 = B260A-13-F: Diode, Schottky Barrier Rectifier, 60 V, 2 A, B260A-13-F
L1 = 74404084221: FIXED IND 220UH 810MA 592 MOHM; ComponentLink1Description: Datasheet; ComponentLink1URL: https://www.we-online.de/katalog/datasheet/74404084221.pdf; ComponentLink2Description: Digikey; ComponentLink2URL: https://www.digikey.com.au/product-detail/en/w%C3%BCrth-elektronik/74404084221/732-7266-1-ND/5353246?fbclid=IwAR2IQj7zcmEUnJ8n40LKmguzerTSd0zliF9ouewbw6PbKBP8Cf58NndJ4Os
R2 = 64k9 1% 0603: Resistor, SMD, 64k9, 0.1W, 5%, 0603
R3 = 1k 5% 0603: Resistor, SMD, 1k, 0.1W, 5%, 0603
R4 = 19k6 1% 0603: Resistor, SMD, 19k6, 0.1W, 5%, 0603

## Sheet PDM-S02-V00-BatteryProtection.SchDoc: Battery Input Protection and Sensing
size A3; DrawnBy: Zoe Goodward; Organization: QUT Motorsport; Address1: O-120, Gardens Point; Address2: 2 George Street; Address3: Brisbane, QLD 4000; Address4: Australia; DocumentNumber: 2; Revision: 01; SheetNumber: 2; SheetTotal: 9; Version: 01; Project: Power Distribution Module; PageSetup: Record=PageOptions|CenterHorizontal=True|CenterVertical=True|PrintScale=0.97|XCorrection=1.00|YCorrection=1.00|PrintKind=0|BorderSize=5000000|LeftOffset=0|BottomOffset=0|Orientation=2|PaperLength=1000|PaperWidth=1000|Scale=100|PaperSource=7|PrintQuality=-4|MediaType=1|DitherType=10|PaperKind=A4|PrintScaleMode=1
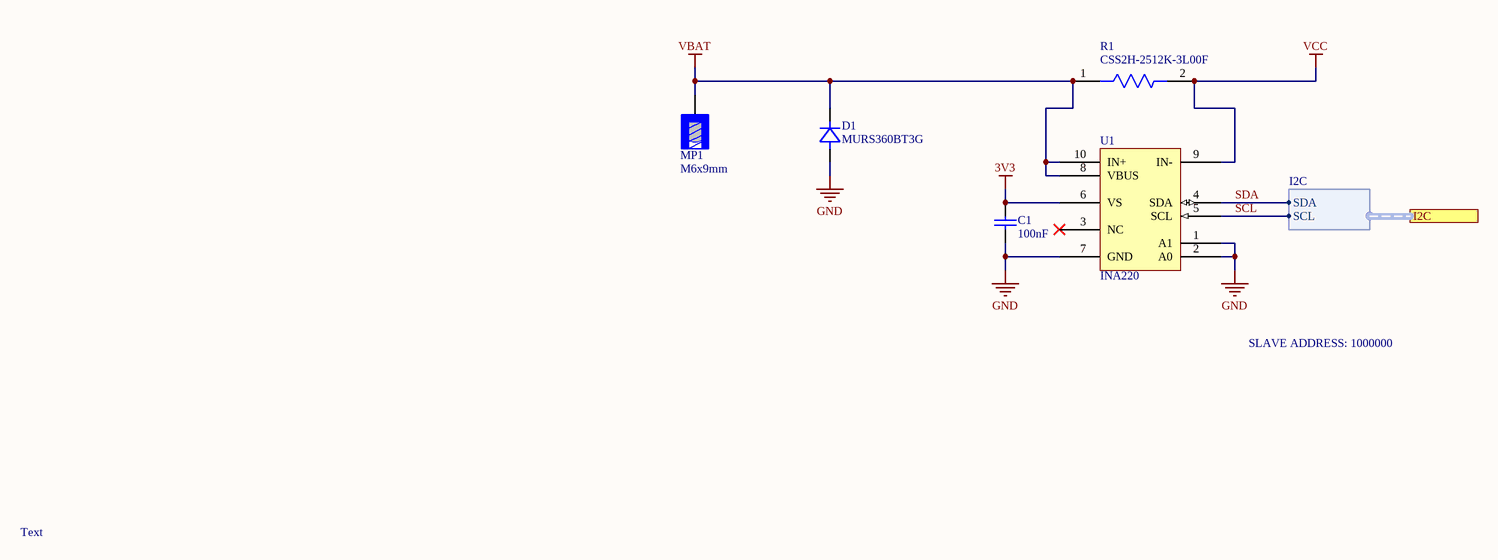
[diagram p5: PDM-S02-V00-BatteryProtection.SchDoc]

### Parts
C1  100nF  [Cap_Ceramic_0603]
D1  MURS360BT3G  [DO-214AA]
MP1  M6x9mm  [7461084_for chemical surfaces]
R1  CSS2H-2512K-3L00F  [CSS2H-2512]
U1  INA220  [VSSOP-10P]

### Ports
I2C (harness I2C)

### Harnesses
I2C: SDA, SCL

### Nets
3V3: C1.2 U1.6(VS)
GND: C1.1 D1.A U1.1(A1) U1.2(A0) U1.7(GND)
VBAT: D1.K MP1.1 R1.1(1_LOAD) U1.8(VBUS) U1.10(IN+)
VCC: R1.2(2_LOAD) U1.9(IN-)
SCL: U1.5(SCL) ; port I2C.SCL
SDA: U1.4(SDA) ; port I2C.SDA

Not connected (* = marked no-connect by the designer): U1 3(NC)*

### Notes on the sheet
- SLAVE ADDRESS: 1000000
- Text
- Revision History:
- Sheet Title:
- Rev
- Date
- Description
- Project:
- Size:
- Drawn By:
- A3
- Number:
- Revision:
- Sheet
- Version:
- of
- QUT Motorsport
- O-120, Gardens Point
- 2 George Street
- Brisbane, QLD 4000
- Australia
- Print Date:
- Print Time:
- File Name:

### Library data of the parts
C1 = 100nF 50V 5% X7R 0603: as C7 on sheet PDM-S04-V00-Microcontroller
D1 = MURS360BT3G: Diode Standard 600V 3A Surface Mount SMB; ComponentLink1Description: Datasheet; ComponentLink1URL: https://www.onsemi.com/pub/Collateral/MURS360BT3-D.PDF; ComponentLink2Description: Digikey; ComponentLink2URL: https://www.digikey.com.au/product-detail/en/on-semiconductor/MURS360BT3G/MURS360BT3GOSCT-ND/3462381
MP1 = 7461084: WP-BUTR Press-Fit with Internal thread, two rows, 10x10mm, 8 pins, M6x9mm, 160A; Pin Number: 8; Thread Length: 9mm; Thread: M6; Surface: Tin; ComponentLink1Description: Manufacturer; ComponentLink1URL: http://www.we-online.de; ComponentLink2Description: Datasheet; ComponentLink2URL: https://katalog.we-online.com/em/datasheet/7461084.pdf; Operating Temperature: -55 to +150degC; Height: 13.5mm; Material: Brass; Part Number: 7461084; Packaging: Bulk; Mounting Technology: Press-Fit; Rated Current: 160A; Publisher: Wurth Elektronik; Published Date: September 2019; Size: 10x10mm
R1 = CSS2H-2512K-3L00F: RES 0.003 OHM 1% 4W 2512; ComponentLink1Description: Datasheet; ComponentLink1URL: https://www.bourns.com/docs/product-datasheets/css2h-2512.pdf; ComponentLink2Description: Digikey; ComponentLink2URL: https://www.digikey.com.au/product-detail/en/bourns-inc/CSS2H-2512K-3L00F/CSS2H-2512K-3L00FCT-ND/6023724
U1 = INA220: INA220-Q1 Automotive Grade, 26-V, Bi-Directional, Zero-Drift, Low- or High-Side, I2C-Compatible Current/Power Monitor; ComponentLink1Description: Datasheet; ComponentLink1URL: https://www.ti.com/lit/ds/symlink/ina220-q1.pdf?HQS=TI-null-null-digikeymode-df-pf-null-wwe&ts=1596508842500; ComponentLink2Description: Digikey; ComponentLink2URL: https://www.digikey.com/product-detail/en/texas-instruments/INA220BQDGSRQ1/296-36593-1-ND/4341289

## Sheet PDM-S07-V00-PDMCConnectorInterface.SchDoc: PDMC Connector Interface
size A3; DrawnBy: Zoe Goodward; Organization: QUT Motorsport; Address1: O-120, Gardens Point; Address2: 2 George Street; Address3: Brisbane, QLD 4000; Address4: Australia; DocumentNumber: 7; Revision: 01; SheetNumber: 7; SheetTotal: 9; Version: 01; Project: Power Distribution Module; PageSetup: Record=PageOptions|CenterHorizontal=True|CenterVertical=True|PrintScale=0.97|XCorrection=1.00|YCorrection=1.00|PrintKind=0|BorderSize=5000000|LeftOffset=0|BottomOffset=0|Orientation=2|PaperLength=1000|PaperWidth=1000|Scale=100|PaperSource=7|PrintQuality=-4|MediaType=1|DitherType=10|PaperKind=A4|PrintScaleMode=1
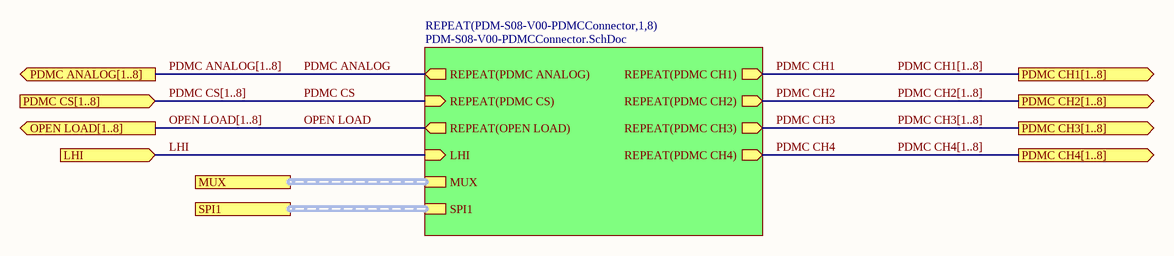
[diagram p6: PDM-S07-V00-PDMCConnectorInterface.SchDoc]

### Sub-sheets
REPEAT(PDM-S08-V00-PDMCConnector,1,8) = PDM-S08-V00-PDMCConnector.SchDoc: REPEAT(PDMC ANALOG) (out), REPEAT(PDMC CS) (in), LHI (in), MUX (harness MUX), SPI1 (harness SPI1), REPEAT(PDMC CH2) (out), REPEAT(PDMC CH1) (out), REPEAT(PDMC CH4) (out), REPEAT(PDMC CH3) (out), REPEAT(OPEN LOAD) (out)

### Ports
LHI (in), MUX (harness MUX), OPEN LOAD[1..8] (out), PDMC ANALOG[1..8] (out), PDMC CH1[1..8] (out), PDMC CH2[1..8] (out), PDMC CH3[1..8] (out), PDMC CH4[1..8] (out), PDMC CS[1..8] (in), SPI1 (harness SPI1)

### Nets
LHI: port LHI, sheet REPEAT(PDM-S08-V00-PDMCConnector,1,8)/LHI
OPEN LOAD: sheet REPEAT(PDM-S08-V00-PDMCConnector,1,8)/REPEAT(OPEN LOAD)
PDMC ANALOG: sheet REPEAT(PDM-S08-V00-PDMCConnector,1,8)/REPEAT(PDMC ANALOG)
PDMC CH1: sheet REPEAT(PDM-S08-V00-PDMCConnector,1,8)/REPEAT(PDMC CH1)
PDMC CH2: sheet REPEAT(PDM-S08-V00-PDMCConnector,1,8)/REPEAT(PDMC CH2)
PDMC CH3: sheet REPEAT(PDM-S08-V00-PDMCConnector,1,8)/REPEAT(PDMC CH3)
PDMC CH4: sheet REPEAT(PDM-S08-V00-PDMCConnector,1,8)/REPEAT(PDMC CH4)
PDMC CS: sheet REPEAT(PDM-S08-V00-PDMCConnector,1,8)/REPEAT(PDMC CS)

### Buses and harness runs
bus OPEN LOAD[1..8] = port OPEN LOAD[1..8]
bus PDMC ANALOG[1..8] = port PDMC ANALOG[1..8]
bus PDMC CH1[1..8] = port PDMC CH1[1..8]
bus PDMC CH2[1..8] = port PDMC CH2[1..8]
bus PDMC CH3[1..8] = port PDMC CH3[1..8]
bus PDMC CH4[1..8] = port PDMC CH4[1..8]
bus PDMC CS[1..8] = port PDMC CS[1..8]
harness port MUX = sheet REPEAT(PDM-S08-V00-PDMCConnector,1,8)/MUX
harness port SPI1 = sheet REPEAT(PDM-S08-V00-PDMCConnector,1,8)/SPI1

### Notes on the sheet
- Revision History:
- Sheet Title:
- Rev
- Date
- Description
- Project:
- Size:
- Drawn By:
- A3
- Number:
- Revision:
- Sheet
- Version:
- of
- QUT Motorsport
- O-120, Gardens Point
- 2 George Street
- Brisbane, QLD 4000
- Australia
- Print Date:
- Print Time:
- File Name:

## Sheet PDM-S08-V00-PDMCConnector.SchDoc: PDMC Connector
size A3; DrawnBy: Zoe Goodward; Organization: QUT Motorsport; Address1: O-120, Gardens Point; Address2: 2 George Street; Address3: Brisbane, QLD 4000; Address4: Australia; DocumentNumber: 8; Revision: 01; SheetNumber: 8; SheetTotal: 9; Version: 01; Project: Power Distribution Module; PageSetup: Record=PageOptions|CenterHorizontal=True|CenterVertical=True|PrintScale=0.97|XCorrection=1.00|YCorrection=1.00|PrintKind=0|BorderSize=5000000|LeftOffset=0|BottomOffset=0|Orientation=2|PaperLength=1000|PaperWidth=1000|Scale=100|PaperSource=7|PrintQuality=-4|MediaType=1|DitherType=10|PaperKind=A4|PrintScaleMode=1
Used 8 times, as channels PDM-S07-V00-PDMCConnectorInterface/PDM-S08-V00-PDMCConnector1, PDM-S07-V00-PDMCConnectorInterface/PDM-S08-V00-PDMCConnector2, PDM-S07-V00-PDMCConnectorInterface/PDM-S08-V00-PDMCConnector3, PDM-S07-V00-PDMCConnectorInterface/PDM-S08-V00-PDMCConnector4, PDM-S07-V00-PDMCConnectorInterface/PDM-S08-V00-PDMCConnector5, PDM-S07-V00-PDMCConnectorInterface/PDM-S08-V00-PDMCConnector6, PDM-S07-V00-PDMCConnectorInterface/PDM-S08-V00-PDMCConnector7, PDM-S07-V00-PDMCConnectorInterface/PDM-S08-V00-PDMCConnector8. Parts and nets are listed once, with the designators drawn on the sheet.
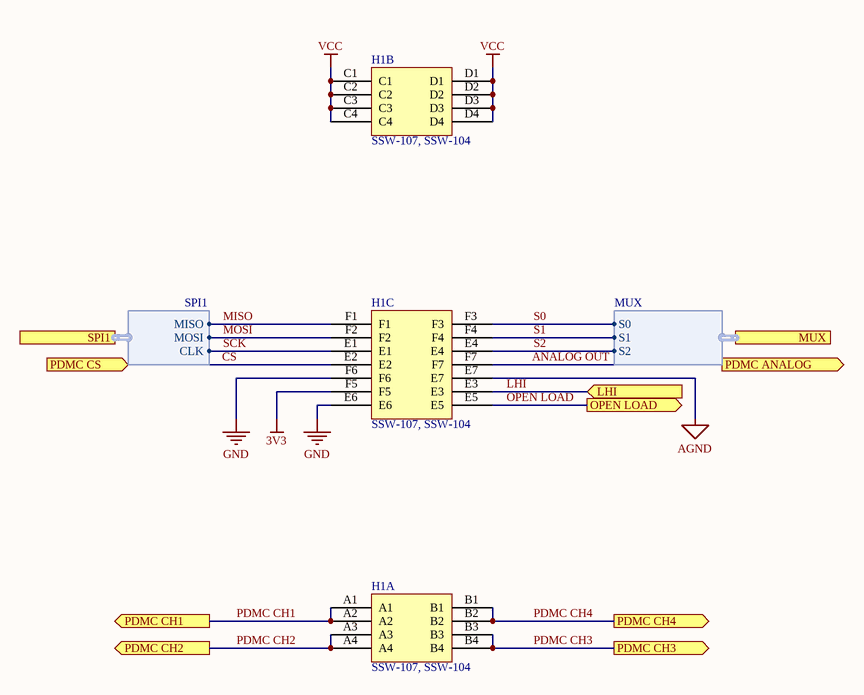
[diagram p7: PDM-S08-V00-PDMCConnector.SchDoc]

### Parts
H1  SSW-107, SSW-104  [SSW-107, SSW-104]  (parts A,B,C of 3)

### Ports
LHI (in), MUX (harness MUX), OPEN LOAD (out), PDMC ANALOG (out), PDMC CH1 (out), PDMC CH2 (out), PDMC CH3 (out), PDMC CH4 (out), PDMC CS (in), SPI1 (harness SPI1)

### Harnesses
MUX: S0, S1, S2
SPI1: MOSI, MISO, CLK

### Nets
3V3: H1.F5
AGND: H1.E7
GND: H1.E6 H1.F6
VCC: H1.C1 H1.C2 H1.C3 H1.C4 H1.D1 H1.D2 H1.D3 H1.D4
ANALOG OUT: H1.F7 ; port PDMC ANALOG
CS: H1.E2 ; port PDMC CS
LHI: H1.E3 ; port LHI
MISO: H1.F1 ; port SPI1.MISO
MOSI: H1.F2 ; port SPI1.MOSI
OPEN LOAD: H1.E5 ; port OPEN LOAD
PDMC CH1: H1.A1 H1.A2 ; port PDMC CH1
PDMC CH2: H1.A3 H1.A4 ; port PDMC CH2
PDMC CH3: H1.B3 H1.B4 ; port PDMC CH3
PDMC CH4: H1.B1 H1.B2 ; port PDMC CH4
S0: H1.F3 ; port MUX.S0
S1: H1.F4 ; port MUX.S1
S2: H1.E4 ; port MUX.S2
SCK: H1.E1 ; port SPI1.CLK

### Channels
PDM-S07-V00-PDMCConnectorInterface/PDM-S08-V00-PDMCConnector1: designators end in A; ports LHI=LHI OPEN LOAD=OPEN LOAD PDMC ANALOG=ANALOG OUT PDMC CH1=PDMC CH1 PDMC CH2=PDMC CH2 PDMC CH3=PDMC CH3 PDMC CH4=PDMC CH4 PDMC CS=CS
PDM-S07-V00-PDMCConnectorInterface/PDM-S08-V00-PDMCConnector2: designators end in B; ports LHI=LHI OPEN LOAD=OPEN LOAD PDMC ANALOG=ANALOG OUT PDMC CH1=PDMC CH1 PDMC CH2=PDMC CH2 PDMC CH3=PDMC CH3 PDMC CH4=PDMC CH4 PDMC CS=CS
PDM-S07-V00-PDMCConnectorInterface/PDM-S08-V00-PDMCConnector3: designators end in C; ports LHI=LHI OPEN LOAD=OPEN LOAD PDMC ANALOG=ANALOG OUT PDMC CH1=PDMC CH1 PDMC CH2=PDMC CH2 PDMC CH3=PDMC CH3 PDMC CH4=PDMC CH4 PDMC CS=CS
PDM-S07-V00-PDMCConnectorInterface/PDM-S08-V00-PDMCConnector4: designators end in D; ports LHI=LHI OPEN LOAD=OPEN LOAD PDMC ANALOG=ANALOG OUT PDMC CH1=PDMC CH1 PDMC CH2=PDMC CH2 PDMC CH3=PDMC CH3 PDMC CH4=PDMC CH4 PDMC CS=CS
PDM-S07-V00-PDMCConnectorInterface/PDM-S08-V00-PDMCConnector5: designators end in E; ports LHI=LHI OPEN LOAD=OPEN LOAD PDMC ANALOG=ANALOG OUT PDMC CH1=PDMC CH1 PDMC CH2=PDMC CH2 PDMC CH3=PDMC CH3 PDMC CH4=PDMC CH4 PDMC CS=CS
PDM-S07-V00-PDMCConnectorInterface/PDM-S08-V00-PDMCConnector6: designators end in F; ports LHI=LHI OPEN LOAD=OPEN LOAD PDMC ANALOG=ANALOG OUT PDMC CH1=PDMC CH1 PDMC CH2=PDMC CH2 PDMC CH3=PDMC CH3 PDMC CH4=PDMC CH4 PDMC CS=CS
PDM-S07-V00-PDMCConnectorInterface/PDM-S08-V00-PDMCConnector7: designators end in G; ports LHI=LHI OPEN LOAD=OPEN LOAD PDMC ANALOG=ANALOG OUT PDMC CH1=PDMC CH1 PDMC CH2=PDMC CH2 PDMC CH3=PDMC CH3 PDMC CH4=PDMC CH4 PDMC CS=CS
PDM-S07-V00-PDMCConnectorInterface/PDM-S08-V00-PDMCConnector8: designators end in H; ports LHI=LHI OPEN LOAD=OPEN LOAD PDMC ANALOG=ANALOG OUT PDMC CH1=PDMC CH1 PDMC CH2=PDMC CH2 PDMC CH3=PDMC CH3 PDMC CH4=PDMC CH4 PDMC CS=CS

### Notes on the sheet
- Revision History:
- Sheet Title:
- Rev
- Date
- Description
- Project:
- Size:
- Drawn By:
- A3
- Number:
- Revision:
- Sheet
- Version:
- of
- QUT Motorsport
- O-120, Gardens Point
- 2 George Street
- Brisbane, QLD 4000
- Australia
- Print Date:
- Print Time:
- File Name:

### Library data of the parts
H1 = SSW-107, SSW-104: CONN RCPT 8POS, 14POS 0.1 TIN PCB; ComponentLink1Description: Datasheet; ComponentLink1URL: http://suddendocs.samtec.com/catalog_english/ssw_th.pdf; ComponentLink2Description: Digikey; ComponentLink2URL: https://www.digikey.com.au/product-detail/en/samtec-inc/SSW-104-01-F-D/SAM10017-ND/6678754; ComponentLink3Description: Digikey; ComponentLink3URL: https://www.digikey.com.au/product-detail/en/samtec-inc/SSW-107-01-F-D/SAM9144-ND/6613824

## Sheet PDM-S05-V00-TempSensor.SchDoc: Temperature Sensor
size A3; DrawnBy: Zoe Goodward; Organization: QUT Motorsport; Address1: O-120, Gardens Point; Address2: 2 George Street; Address3: Brisbane, QLD 4000; Address4: Australia; DocumentNumber: 5; Revision: 01; SheetNumber: 5; SheetTotal: 9; Version: 01; Project: Power Distribution Module; PageSetup: Record=PageOptions|CenterHorizontal=True|CenterVertical=True|PrintScale=0.97|XCorrection=1.00|YCorrection=1.00|PrintKind=0|BorderSize=5000000|LeftOffset=0|BottomOffset=0|Orientation=2|PaperLength=1000|PaperWidth=1000|Scale=100|PaperSource=7|PrintQuality=-4|MediaType=1|DitherType=10|PaperKind=A4|PrintScaleMode=1
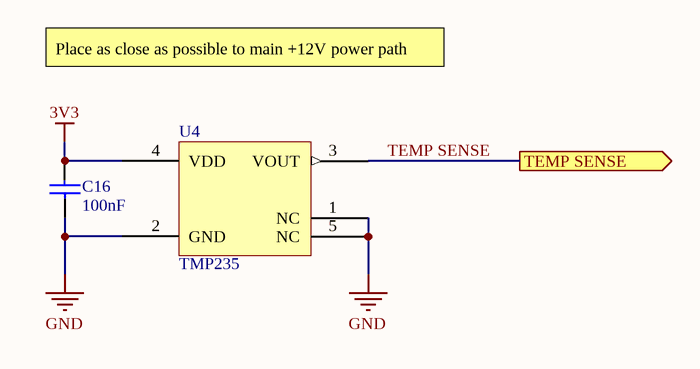
[diagram p8: PDM-S05-V00-TempSensor.SchDoc]

### Parts
C16  100nF  [Cap_Ceramic_0603]
U4  TMP235  [SC70]

### Ports
TEMP SENSE (out)

### Nets
3V3: C16.2 U4.4(VDD)
GND: C16.1 U4.1(NC) U4.2(GND) U4.5(NC)
TEMP SENSE: U4.3(VOUT) ; port TEMP SENSE

### Notes on the sheet
- Place as close as possible to main +12V power path
- Revision History:
- Sheet Title:
- Rev
- Date
- Description
- Project:
- Size:
- Drawn By:
- A3
- Number:
- Revision:
- Sheet
- Version:
- of
- QUT Motorsport
- O-120, Gardens Point
- 2 George Street
- Brisbane, QLD 4000
- Australia
- Print Date:
- Print Time:
- File Name:

### Library data of the parts
C16 = 100nF 50V 5% X7R 0603: as C7 on sheet PDM-S04-V00-Microcontroller
U4 = TMP235: TMP235, Low-Power, High-Accuracy Analog Output Temperature Sensor; ComponentLink1Description: Datasheet; ComponentLink1URL: https://www.ti.com/lit/ds/symlink/tmp235.pdf?HQS=TI-null-null-digikeymode-df-pf-null-wwe&ts=1595645947985; ComponentLink2Description: Digikey; ComponentLink2URL: https://www.digikey.com.au/product-detail/en/texas-instruments/TMP235A4DCKR/296-50016-1-ND/9462854

## Sheet PDM-S10-V00-SDCard.SchDoc: SD Card
size A3; DrawnBy: Zoe Goodward; Organization: QUT Motorsport; Address1: O-120, Gardens Point; Address2: 2 George Street; Address3: Brisbane, QLD 4000; Address4: Australia; DocumentNumber: ####; Revision: 01; SheetNumber: 1; SheetTotal: 1; Version: 01; Project: Power Distribution Module; PageSetup: Record=PageOptions|CenterHorizontal=True|CenterVertical=True|PrintScale=0.97|XCorrection=1.00|YCorrection=1.00|PrintKind=0|BorderSize=5000000|LeftOffset=0|BottomOffset=0|Orientation=2|PaperLength=1000|PaperWidth=1000|Scale=100|PaperSource=7|PrintQuality=-4|MediaType=1|DitherType=10|PaperKind=A4|PrintScaleMode=1
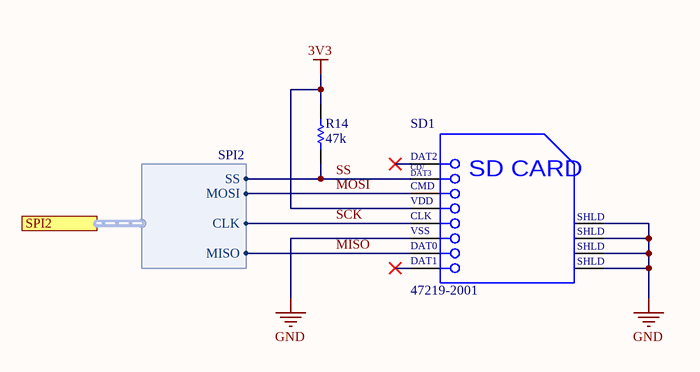
[diagram p9: PDM-S10-V00-SDCard.SchDoc]

### Parts
R14  47k  [Res_ThinFilm_0603]
SD1  47219-2001  [MOLX-47219-2001-8_V]

### Ports
SPI2 (harness SPI2)

### Harnesses
SPI2: SS, MOSI, CLK, MISO

### Nets
3V3: R14.2 SD1.4(VDD)
GND: SD1.6(VSS) SD1.9(SHLD) SD1.10(SHLD) SD1.11(SHLD) SD1.12(SHLD)
MISO: SD1.7(DAT0) ; port SPI2.MISO
MOSI: SD1.3(CMD) ; port SPI2.MOSI
SCK: SD1.5(CLK) ; port SPI2.CLK
SS: R14.1 SD1.2(CD/DAT3) ; port SPI2.SS  [project net SPI2 SS]

Not connected (* = marked no-connect by the designer): SD1 1(DAT2)* 8(DAT1)*

### Notes on the sheet
- Revision History:
- Sheet Title:
- Rev
- Date
- Description
- Project:
- Size:
- Drawn By:
- A3
- Number:
- Revision:
- Sheet
- Version:
- of
- QUT Motorsport
- O-120, Gardens Point
- 2 George Street
- Brisbane, QLD 4000
- Australia
- Print Date:
- Print Time:
- File Name:
- (in symbol 47219-2001) CD/; DAT3; SD CARD

### Library data of the parts
R14 = 47k 5% 0603: Resistor, SMD, 47k, 0.1W, 5%, 0603
SD1 = 47219-2001: MicroSD Card Connector, Hinge Type, -40 to 85 degC, 8-Pin SMD, RoHS, Tape and Reel; Manufacturer: Molex; Current Rating: 500mA; Number of Contacts: 8; Pitch: 1.09mm; Insertion - Extraction Style: Hinged; Voltage Rating: 100VDC; Product: CardConnectors; Contact Material: CopperAlloy; Series: 47219; Packaging: Reel; Brand: Molex; Product Category: MemoryCardConnectors; Housing Material: Thermoplastic; Mounting Style: SMD/SMT; Termination Style: SMD; Datasheet Version: Rev. F, 06/2009; Card Type: microSD; Manufacturer URL: http://www.molex.com/; RoHS: Details; Datasheet URL: http://www.molex.com/pdm_docs/sd/472192001_sd.pdf; Factory Pack Quantity: 2400

## Sheet PDM-S11-V00-IMU.SchDoc: IMU
size A3; DrawnBy: Zoe Goodward; Organization: QUT Motorsport; Address1: O-120, Gardens Point; Address2: 2 George Street; Address3: Brisbane, QLD 4000; Address4: Australia; DocumentNumber: ####; Revision: 01; SheetNumber: 1; SheetTotal: 1; Version: 01; Project: Power Distribution Module; PageSetup: Record=PageOptions|CenterHorizontal=True|CenterVertical=True|PrintScale=0.97|XCorrection=1.00|YCorrection=1.00|PrintKind=0|BorderSize=5000000|LeftOffset=0|BottomOffset=0|Orientation=2|PaperLength=1000|PaperWidth=1000|Scale=100|PaperSource=7|PrintQuality=-4|MediaType=1|DitherType=10|PaperKind=A4|PrintScaleMode=1
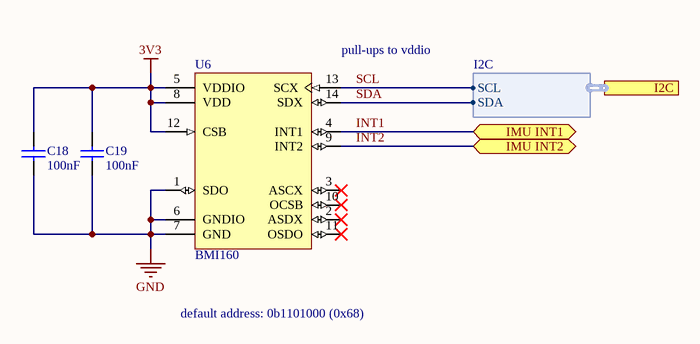
[diagram p10: PDM-S11-V00-IMU.SchDoc]

### Parts
C18  100nF  [Cap_Ceramic_0603]
C19  100nF  [Cap_Ceramic_0603]
U6  BMI160  [BOSC-BMI160_V]

### Ports
I2C (harness I2C), IMU INT1 (bidir), IMU INT2 (bidir)

### Harnesses
I2C: SDA, SCL

### Nets
3V3: C18.2 C19.2 U6.5(VDDIO) U6.8(VDD) U6.12(CSB)
GND: C18.1 C19.1 U6.1(SDO) U6.6(GNDIO) U6.7(GND)
INT1: U6.4(INT1) ; port IMU INT1  [project net IMU INT1]
INT2: U6.9(INT2) ; port IMU INT2  [project net IMU INT2]
SCL: U6.13(SCX) ; port I2C.SCL
SDA: U6.14(SDX) ; port I2C.SDA

Not connected (* = marked no-connect by the designer): U6 2(ASDX)* 3(ASCX)* 10(OCSB)* 11(OSDO)*

### Notes on the sheet
- (near U6) pull-ups to vddio
- default address: 0b1101000 (0x68)
- Revision History:
- Sheet Title:
- Rev
- Date
- Description
- Project:
- Size:
- Drawn By:
- A3
- Number:
- Revision:
- Sheet
- Version:
- of
- QUT Motorsport
- O-120, Gardens Point
- 2 George Street
- Brisbane, QLD 4000
- Australia
- Print Date:
- Print Time:
- File Name:

### Library data of the parts
C18 C19 = 100nF 50V 5% X7R 0603: as C7 on sheet PDM-S04-V00-Microcontroller
U6 = BMI160: Small, low Power Inertial Measurement Unit, 1.2 to 3.6 V, -40 to 85 degC, 14-Pin LGA, Halogen-Free, Tape and Reel; Manufacturer: Bosch; Datasheet URL: https://ae-bst.resource.bosch.com/media/_tech/media/datasheets/BST-BMI160-DS000-07.pdf; Package Description: 14-Pullback Quad Flat No-Lead, Body 3 x 2.5 mm, Pitch 0.5 mm; Lead Free: LeadFree; Datasheet Version: Rev. 0.8, 02/2015; Mounting Technology: SurfaceMount; Manufacturer URL: https://www.bosch.com/; Package Reference: BMI160; RoHSCompliant: false

## Sheet PDM-S12-V00-InputProtection.SchDoc: Digital Input Protection
size A3; DrawnBy: Zoe Goodward; Organization: QUT Motorsport; Address1: O-120, Gardens Point; Address2: 2 George Street; Address3: Brisbane, QLD 4000; Address4: Australia; DocumentNumber: ####; Revision: 00; SheetNumber: 1; SheetTotal: 1; Version: 00; Project: Power Distribution Module; PageSetup: Record=PageOptions|CenterHorizontal=True|CenterVertical=True|PrintScale=0.97|XCorrection=1.00|YCorrection=1.00|PrintKind=0|BorderSize=5000000|LeftOffset=0|BottomOffset=0|Orientation=2|PaperLength=1000|PaperWidth=1000|Scale=100|PaperSource=7|PrintQuality=-4|MediaType=1|DitherType=10|PaperKind=A4|PrintScaleMode=1
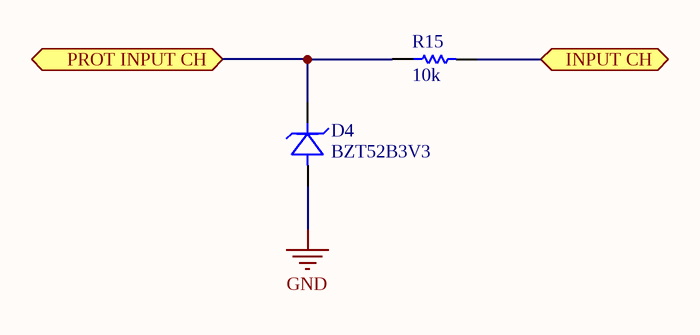
[diagram p11: PDM-S12-V00-InputProtection.SchDoc]

### Parts
D4  BZT52B3V3  [SOD123]
R15  10k  [Res_ThinFilm_0603]

### Ports
INPUT CH (bidir), PROT INPUT CH (bidir)

### Nets
GND: D4.A(Anode)
NetD4_K: D4.K(Cathode) R15.1 ; port PROT INPUT CH
NetR15_2: R15.2 ; port INPUT CH

### Notes on the sheet
- Revision History:
- Sheet Title:
- Rev
- Date
- Description
- Project:
- Size:
- Drawn By:
- A3
- Number:
- Revision:
- Sheet
- Version:
- of
- QUT Motorsport
- O-120, Gardens Point
- 2 George Street
- Brisbane, QLD 4000
- Australia
- Print Date:
- Print Time:
- File Name:

### Library data of the parts
D4 = BZT52B3V3: as D6 on sheet PDM-S04-V00-Microcontroller; ComponentLink1Description: Datasheet; ComponentLink1URL: https://www.vishay.com/docs/85760/bzt52.pdf; ComponentLink2Description: Digikey; ComponentLink2URL: https://www.digikey.com/product-detail/en/vishay-semiconductor-diodes-division/BZT52B3V3-E3-08/112-BZT52B3V3-E3-08CT-ND/8564806
R15 = 10k 5% 0603: Resistor, SMD, 10k, 0.1W, 5%, 0603